# EAGLE design AliDualVar_B (EAGLE 7.2.0)
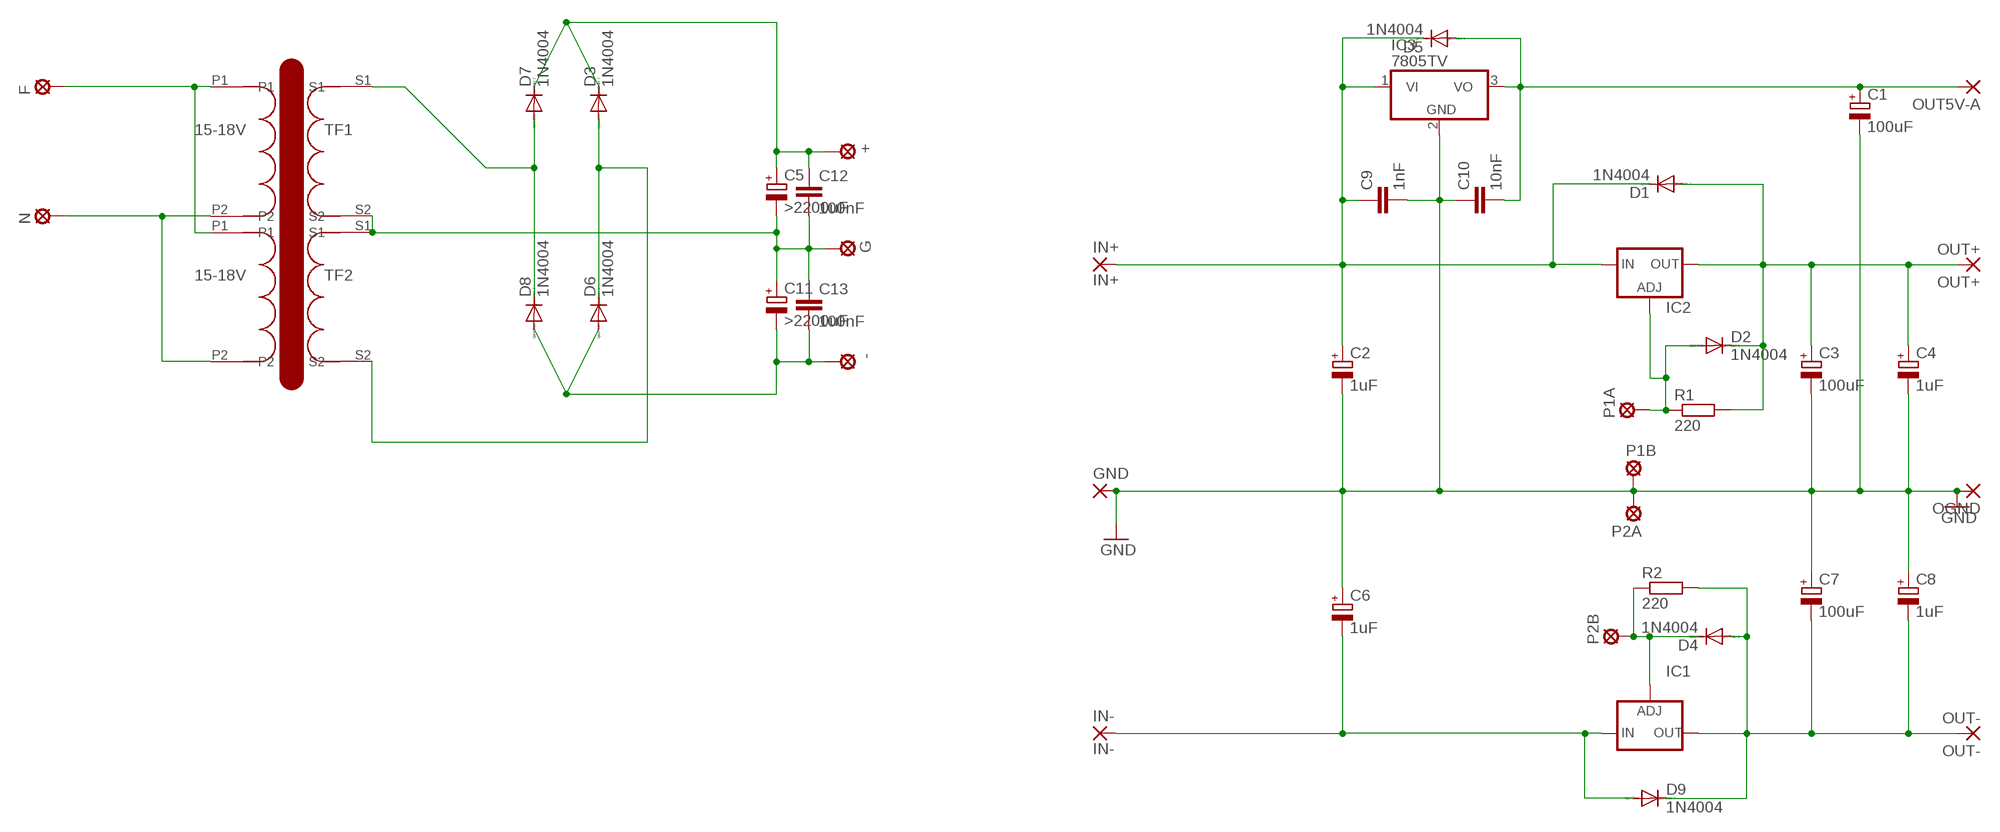
[diagram p0: schematic, sheet 1]

## Parts
+  LSP10  [LSP10]
-  LSP10  [LSP10]
C1  100uF  CPOL-EUE5-13  [E5-13]
C2  1uF  CPOL-EUE5-13  [E5-13]
C3  100uF  CPOL-EUE5-13  [E5-13]
C4  1uF  CPOL-EUE5-13  [E5-13]
C5  >2200uF  CPOL-EUE7.5-16  [E7,5-16]
C6  1uF  CPOL-EUE5-13  [E5-13]
C7  100uF  CPOL-EUE5-13  [E5-13]
C8  1uF  CPOL-EUE5-13  [E5-13]
C9  1nF  C-EU025-024X044  [C025-024X044]
C10  10nF  C-EU025-024X044  [C025-024X044]
C11  >2200uF  CPOL-EUE7.5-16  [E7,5-16]
C12  100nF  C-EU050-035X075  [C050-035X075]
C13  100nF  C-EU050-035X075  [C050-035X075]
D1  1N4004  [DO41-10]
D2  1N4004  [DO41-10]
D3  1N4004  [DO41-10]
D4  1N4004  [DO41-10]
D5  1N4004  [DO41-10]
D6  1N4004  [DO41-10]
D7  1N4004  [DO41-10]
D8  1N4004  [DO41-10]
D9  1N4004  [DO41-10]
F  LSP10  [LSP10]
G  LSP10  [LSP10]
GND  3,81/1,4  [3,81/1,4]
IC1  LM337TS  [337TS]
IC2  LM317TS  [317TS]
IC3  7805TV  [TO220V]
IN+  IN+  3,81/1,4  [3,81/1,4]
IN-  IN-  3,81/1,4  [3,81/1,4]
N  LSP10  [LSP10]
OGND  3,81/1,4  [3,81/1,4]
OUT5V-A  3,81/1,4  [3,81/1,4]
OUT+  OUT+  3,81/1,4  [3,81/1,4]
OUT-  OUT-  3,81/1,4  [3,81/1,4]
P1A  LSP10  [LSP10]
P1B  LSP10  [LSP10]
P2A  LSP10  [LSP10]
P2B  LSP10  [LSP10]
R1  220  R-EU_0207/7  [0207/7]
R2  220  R-EU_0207/7  [0207/7]
TF1  15-18V  TRASFORMATORE_1_A  [TRASFORMATORE_1_A]
TF2  15-18V  TRASFORMATORE_1_A  [TRASFORMATORE_1_A]

## Nets
GND: C1.- C2.- C3.- C4.- C6.+ C7.+ C8.+ C9.2 C10.1 GND.1(P) IC3.2(GND) OGND.1(P) P1B.MP P2A.MP
N$1: C7.- C8.- D4.A D9.C IC1.3(OUT) OUT-.1(P) R2.2
N$2: C3.+ C4.+ D1.A D2.C IC2.2(OUT) OUT+.1(P) R1.2
N$3: F.MP TF1.P1 TF2.P1
N$4: C1.+ C10.2 D5.A IC3.3(VO) OUT5V-A.1(P)
N$5: D2.A IC2.1(ADJ) P1A.MP R1.1
N$6: D4.C IC1.1(ADJ) P2B.MP R2.1
N$7: D7.A D8.C TF1.S1
N$8: C6.- D9.A IC1.2(IN) IN-.1(P)
N$9: D3.A D6.C TF2.S2
N$12: C2.+ C9.1 D1.C D5.C IC2.3(IN) IC3.1(VI) IN+.1(P)
N$14: +.MP C5.+ C12.1 D3.C D7.C
N$17: N.MP TF1.P2 TF2.P2
N$18: C5.- C11.+ C12.2 C13.1 G.MP TF1.S2 TF2.S1
N$22: -.MP C11.- C13.2 D6.A D8.A

## Library data of the parts
+ - F G N P1A P1B P2A P2B = solpad:LSP10: SOLDER PAD drill 1.0 mm, distributor Buerklin, 12H555
C1-C8 C11 = resistor:CPOL-EU: POLARIZED CAPACITOR, European symbol
C9 C10 = rcl:C-EU: CAPACITOR, European symbol
C12 C13 = resistor:C-EU: CAPACITOR, European symbol
D1-D9 = diode:1N4004: DIODE general purpose rectifier, 1 A
GND IN+ IN- OGND OUT5V-A OUT+ OUT- = wirepad:3,81/1,4: THROUGH-HOLE PAD
IC1 = v-reg:LM337TS: VOLTAGE REGULATOR
IC2 = v-reg:LM317TS: VOLTAGE REGULATOR
IC3 = linear:78*: Positive VOLTAGE REGULATOR Source: http://cache.national.com/ds/LM/LM78L05.pdf http://www.fairchildsemi.com/ds/LM/LM7805.pdf
R1 R2 = resistor:R-EU_: RESISTOR, European symbol
TF1 TF2 = Erik:TRASFORMATORE_1_A

## Net classes
0 default: clearance 0.205 mm

## Board
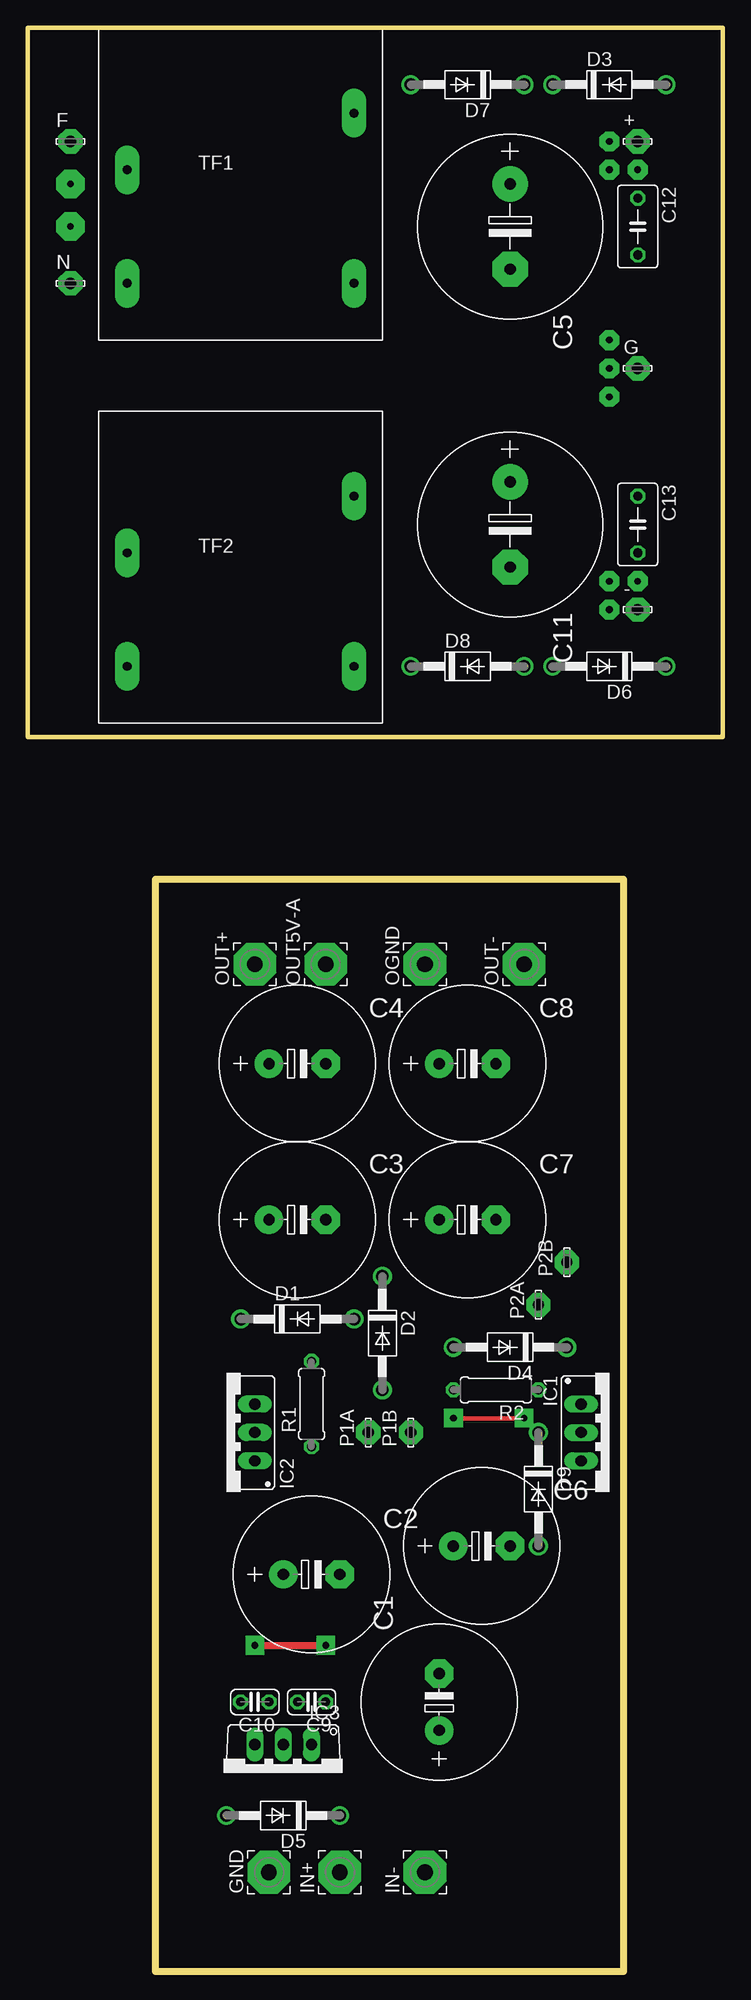
[diagram p1: board, top side]
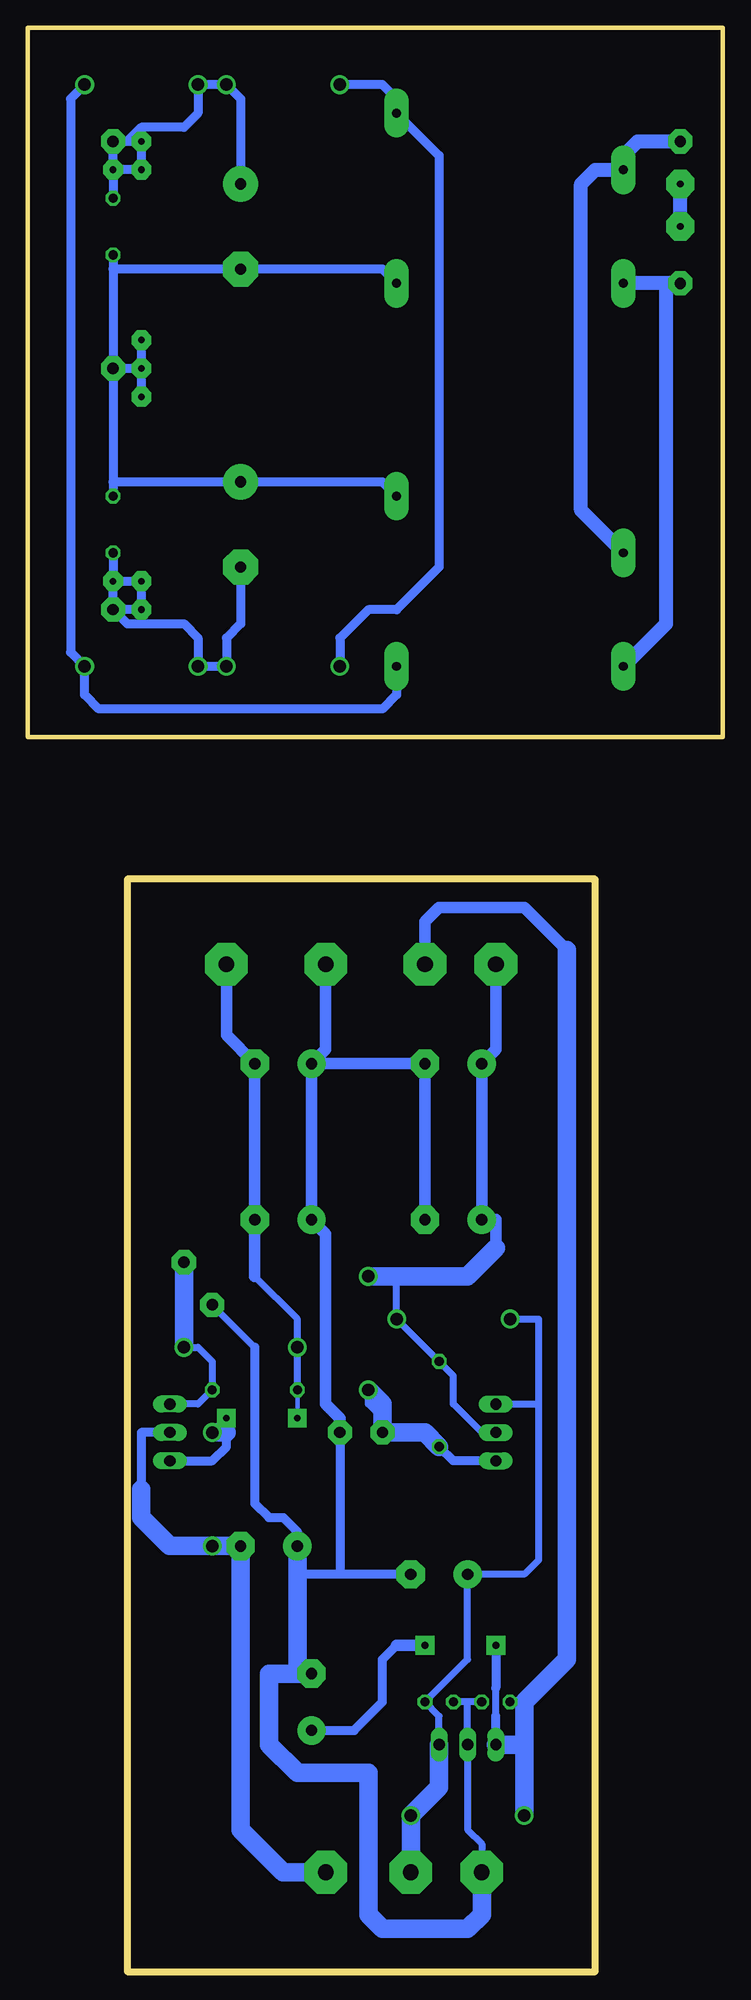
[diagram p2: board, bottom side, seen from below]

Size 62.23 x 173.99 mm. Coordinates in mm from the lower left corner, seen from the top.
Outline: 11.43,97.79 53.34,97.79 53.34,0 11.43,0 11.43,97.79
Outline: 0,173.99 0,110.49 62.23,110.49 62.23,173.99 0,173.99
Copper layers (1*16): Top 0.035mm / dielectric 1.5mm / Bottom 0.035mm
Design rules "default": minimum track width 10mil, minimum drill 24mil, track to track 8mil, track to pad 8mil, pad to pad 8mil, via to via 8mil, smd to smd 8mil, copper to edge 40mil, drill to drill 8mil, minimum pad ring 10mil, minimum via ring 8mil, stop-mask expansion 4mil, vias tented up to drill 0mil, thermal gap 10mil

### Footprints (pad centres in the part's own frame; a part is rotated, then mirrored left to right if it is on the bottom)
LSP10 = drill 1.016 pad 2.159 octagon: MP 0,0
E5-13 = drill 1.016 pad 2.54: + -2.54,0 | drill 1.016 pad 2.54 octagon: - 2.54,0
E7,5-16 = drill 1.016 pad 3.15: + -3.81,0 | drill 1.016 pad 3.15 octagon: - 3.81,0
C025-024X044 = drill 0.813 octagon: 1 -1.27,0; 2 1.27,0
C050-035X075 = drill 0.813 octagon: 1 -2.54,0; 2 2.54,0
DO41-10 = drill 1.118: A 5.08,0; C -5.08,0
3,81/1,4 = drill 1.397 pad 3.81 octagon: 1 0,0
337TS = drill 1.016 long: 1 -2.54,-2.54; 2 0,-2.54; 3 2.54,-2.54
317TS = drill 1.016 long: 1 -2.54,-2.54; 2 0,-2.54; 3 2.54,-2.54
TO220V = drill 1.016 long: 1 -2.54,-2.54; 2 0,-2.54; 3 2.54,-2.54
0207/7 = drill 0.813 octagon: 1 -3.81,0; 2 3.81,0
TRASFORMATORE_1_A = drill 0.8 pad 2.184 long: P1 -10.16,-3.81; P2 -10.16,-13.97; S1 10.16,1.27; S2 10.16,-13.97

### Placement (x,y rotation side)
+  54.61,163.83 0 top
-  54.61,121.92 0 top
C1  36.83,24.13 90 top
C2  25.4,35.56 0 top
C3  24.13,67.31 0 top
C4  24.13,81.28 0 top
C5  43.18,156.21 270 top
C6  40.64,38.1 0 top
C7  39.37,67.31 0 top
C8  39.37,81.28 0 top
C9  25.4,24.13 180 top
C10  20.32,24.13 180 top
C11  43.18,129.54 270 top
C12  54.61,156.21 270 top
C13  54.61,129.54 270 top
D1  24.13,58.42 0 top
D2  31.75,57.15 270 top
D3  52.07,168.91 0 top
D4  43.18,55.88 180 top
D5  22.86,13.97 180 top
D6  52.07,116.84 180 top
D7  39.37,168.91 180 top
D8  39.37,116.84 0 top
D9  45.72,43.18 270 top
F  3.81,163.83 0 top
G  54.61,143.51 0 top
GND  21.59,8.89 90 top
IC1  52.07,48.26 270 top
IC2  17.78,48.26 90 top
IC3  22.86,17.78 180 top
IN+  27.94,8.89 90 top
IN-  35.56,8.89 90 top
N  3.81,151.13 0 top
OGND  35.56,90.17 90 top
OUT5V-A  26.67,90.17 90 top
OUT+  20.32,90.17 90 top
OUT-  44.45,90.17 90 top
P1A  30.48,48.26 90 top
P1B  34.29,48.26 90 top
P2A  45.72,59.69 90 top
P2B  48.26,63.5 90 top
R1  25.4,50.8 90 top
R2  41.91,52.07 180 top
TF1  19.05,165.1 0 top
TF2  19.05,130.81 0 top

### Tracks (layer width: path | path; a pad name or v marks a point on that pad's centre or on a via)
GND
  Bottom 0.61: P2A.MP 41.91,55.88 | C10.1 22.86,24.13 | 22.86,24.13 C9.2 | 22.86,24.13 IC3.2 22.86,12.7 21.59,11.43 GND.1 | 40.64,20.32 40.64,25.4 39.37,26.67 38.1,26.67
  Bottom 0.813: 41.91,55.88 41.91,41.91 40.64,40.64 39.37,40.64 38.1,39.37 C6.+ | C2.- 34.29,35.56 | 34.29,35.56 38.1,35.56 | P1B.MP 34.29,35.56
  Bottom 1.016: C3.- C4.- C8.+ | C8.+ C7.+ 35.56,66.04 35.56,50.8 34.29,49.53 P1B.MP | C8.+ 35.56,82.55 OGND.1
  Bottom 1.676: GND.1 21.59,5.08 22.86,3.81 30.48,3.81 31.75,5.08 31.75,17.78 38.1,17.78 40.64,20.32 40.64,26.67 38.1,26.67 | 38.1,26.67 C1.- | C6.+ 38.1,35.56 38.1,26.67
N$1  (via drill 0.6 pad 1.68)
  Top 0.406: v38.1,49.53 v44.45,49.53
  Bottom 0.406: R2.2 v38.1,49.53
  Bottom 0.61: R2.2 D4.A 38.1,58.42 41.91,62.23
  Bottom 0.813: IC1.3 45.72,45.72 44.45,46.99 44.45,48.26 v44.45,49.53
  Bottom 1.016: 41.91,62.23 C7.- C8.- 44.45,83.82 OUT-.1
  Bottom 1.676: D9.C 44.45,48.26
N$2
  Bottom 0.61: D2.C 29.21,62.23 | 29.21,62.23 24.13,62.23 | IC2.2 21.59,48.26 24.13,50.8 24.13,53.34 R1.2 D1.A 29.21,62.23
  Bottom 1.016: OUT+.1 20.32,82.55 C4.+ C3.+ 20.32,67.31 20.32,64.77
  Bottom 1.676: 20.32,64.77 22.86,62.23 24.13,62.23 D2.C
N$3
  Bottom 1.27: F.MP 7.62,163.83 8.89,162.56 TF1.P1 11.43,161.29 12.7,160.02 12.7,130.81 TF2.P1
N$4  (via drill 0.6 pad 1.68)
  Top 0.61: v20.32,29.21 v26.67,29.21
  Bottom 0.61: 17.78,20.32 17.78,24.13 C10.2 | 20.32,22.86 20.32,25.4
  Bottom 0.813: C1.+ 33.02,21.59 30.48,24.13 30.48,27.94 29.21,29.21 | IC3.3 20.32,22.86 | v20.32,29.21 20.32,25.4
  Bottom 1.016: 13.97,91.44 17.78,95.25 25.4,95.25 26.67,93.98 OUT5V-A.1 | 29.21,29.21 v26.67,29.21
  Bottom 1.676: IC3.3 17.78,20.32 D5.A 17.78,24.13 13.97,27.94 13.97,91.44
N$5
  Bottom 0.61: P1A.MP 30.48,49.53 31.75,50.8 D2.A
  Bottom 0.813: IC2.1 24.13,45.72 R1.1
  Bottom 1.676: R1.1 26.67,48.26 P1A.MP 30.48,50.8 D2.A
N$6
  Bottom 0.61: D4.C 46.99,55.88 45.72,54.61 R2.1 46.99,50.8 IC1.1
  Bottom 1.676: D4.C P2B.MP
N$7
  Bottom 0.813: D7.A 30.48,168.91 29.21,167.64 TF1.S1 25.4,162.56 25.4,125.73 29.21,121.92 31.75,121.92 34.29,119.38 D8.C
N$8
  Bottom 0.813: IC1.2 52.07,48.26 52.07,43.18
  Bottom 1.676: IN-.1 39.37,8.89 43.18,12.7 C6.- D9.A 49.53,38.1 52.07,40.64 52.07,43.18
N$9
  Bottom 0.813: D3.A 58.42,167.64 58.42,118.11 D6.C 57.15,114.3 55.88,113.03 30.48,113.03 29.21,114.3 TF2.S2
N$12
  Bottom 0.61: IC3.1 25.4,22.86 C9.1 22.86,27.94 C2.+ 17.78,35.56 16.51,36.83 16.51,50.8 | D1.C 16.51,58.42 16.51,50.8 | IC2.3 16.51,50.8
  Bottom 1.676: IN+.1 D5.C 25.4,16.51 IC3.1
N$14  (via drill 0.6 pad 1.78)
  Bottom 0.813: v54.61,161.29 C12.1 | C5.+ 43.18,167.64 D7.C D3.C 46.99,166.37 48.26,165.1 52.07,165.1 53.34,163.83 +.MP | v54.61,161.29 v52.07,161.29 v52.07,163.83 +.MP | v54.61,161.29 +.MP
N$17
  Bottom 1.27: N.MP 5.08,151.13 | 5.08,151.13 TF1.P2 | TF2.P2 5.08,120.65 5.08,151.13
N$18  (via drill 0.6 pad 1.78)
  Bottom 0.813: v52.07,146.05 52.07,143.51 | 52.07,143.51 v52.07,140.97 | C12.2 54.61,152.4 | 54.61,152.4 G.MP | G.MP 54.61,133.35 | 54.61,133.35 C13.1 | 54.61,152.4 C5.- 30.48,152.4 TF1.S2 | 54.61,133.35 C11.+ 30.48,133.35 TF2.S1 | 52.07,143.51 G.MP
N$19  (via drill 0.6 pad 1.78)
  other vias: 52.07,143.51
N$22  (via drill 0.6 pad 1.78)
  Bottom 0.813: v52.07,124.46 v52.07,121.92 -.MP | C11.- 43.18,120.65 44.45,119.38 D8.A D6.A 46.99,119.38 48.26,120.65 52.07,120.65 | C13.2 v54.61,124.46 | -.MP 53.34,120.65 52.07,120.65 | -.MP v54.61,124.46 | v54.61,124.46 v52.07,124.46 | v52.07,124.46 52.07,120.65
N$23  (via drill 0.6 pad 2.54)
  Bottom 1.27: v3.81,156.21 v3.81,160.02